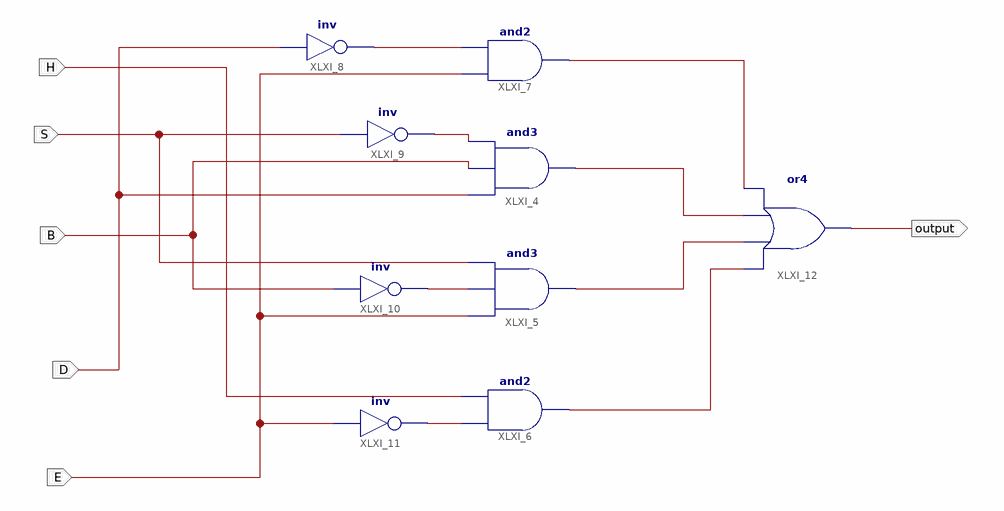
[diagram p0: schematic sheet 1]
// Xilinx ISE schematic SynLab4.sch (spartan6) as structural Verilog: 9 symbols, 6 ports
module SynLab4 (
  input  D,
  input  H,
  input  E,
  input  S,
  input  B,
  output \output 
);

  wire XLXN_8, XLXN_9, XLXN_10, XLXN_11, XLXN_21, XLXN_24, XLXN_25, XLXN_26;

  and XLXI_4 (XLXN_26, D, B, XLXN_10);
  and XLXI_5 (XLXN_24, E, XLXN_9, S);
  and XLXI_6 (XLXN_25, XLXN_8, H);
  and XLXI_7 (XLXN_21, E, XLXN_11);
  not XLXI_8 (XLXN_11, D);
  not XLXI_10 (XLXN_9, B);
  not XLXI_9 (XLXN_10, S);
  not XLXI_11 (XLXN_8, E);
  or XLXI_12 (\output , XLXN_25, XLXN_24, XLXN_26, XLXN_21);
endmodule
